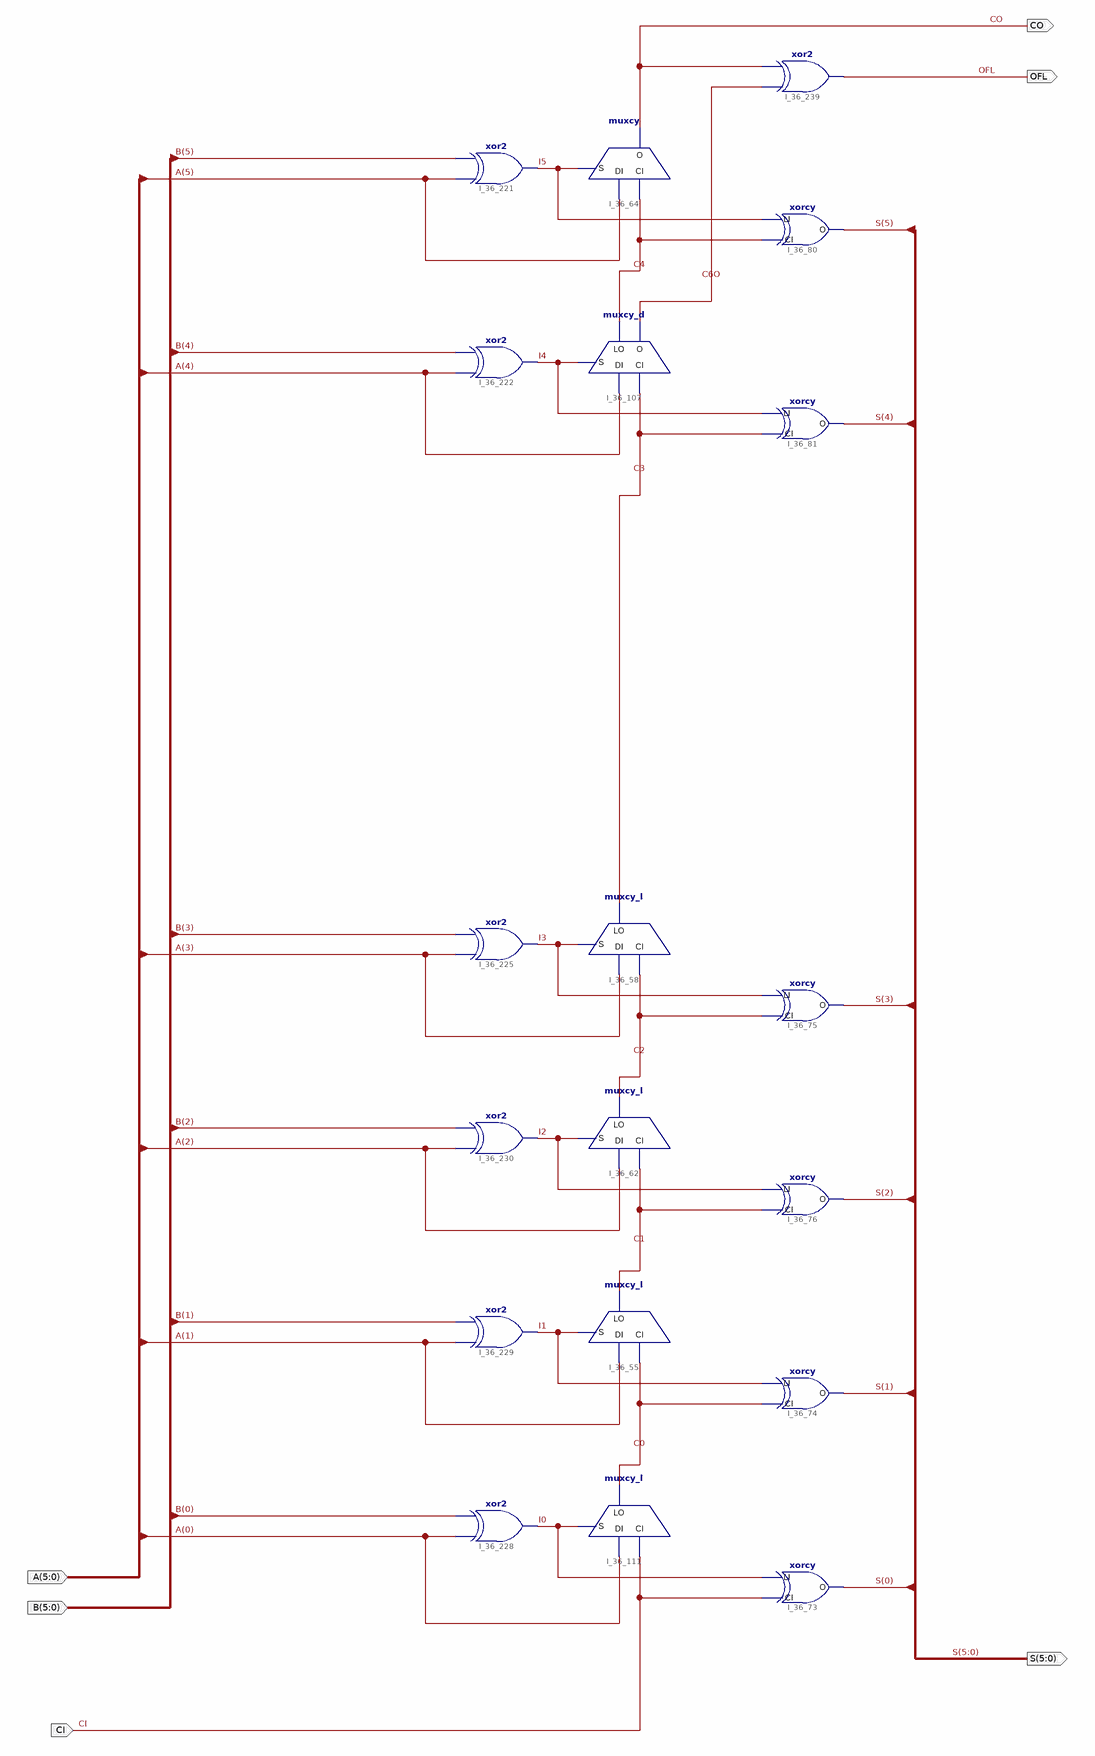
[diagram p0: schematic sheet 1]
// Xilinx ISE schematic add6.sch (spartan3e) as structural Verilog: 19 symbols, 6 ports
module add6 (
  input  CI,
  input  [5:0] B,
  input  [5:0] A,
  output CO,
  output OFL,
  output [5:0] S
);

  wire C0, C1, C2, C3, C4, C6O, I0, I1, I2, I3, I4, I5;

  muxcy_l #(.RLOC("X0Y1")) I_36_58 (.CI(C2), .DI(A[3]), .S(I3), .LO(C3));
  muxcy_l #(.RLOC("X0Y1")) I_36_62 (.CI(C1), .DI(A[2]), .S(I2), .LO(C2));
  muxcy_l #(.RLOC("X0Y0")) I_36_55 (.CI(C0), .DI(A[1]), .S(I1), .LO(C1));
  muxcy_l #(.RLOC("X0Y0")) I_36_111 (.CI(CI), .DI(A[0]), .S(I0), .LO(C0));
  xorcy I_36_80 (.CI(C4), .LI(I5), .O(S[5]));
  xorcy I_36_81 (.CI(C3), .LI(I4), .O(S[4]));
  xorcy I_36_75 (.CI(C2), .LI(I3), .O(S[3]));
  xorcy I_36_76 (.CI(C1), .LI(I2), .O(S[2]));
  xorcy I_36_74 (.CI(C0), .LI(I1), .O(S[1]));
  xorcy I_36_73 (.CI(CI), .LI(I0), .O(S[0]));
  muxcy #(.RLOC("X0Y3")) I_36_64 (.CI(C4), .DI(A[5]), .S(I5), .O(CO));
  xor I_36_221 (I5, A[5], B[5]);
  xor I_36_225 (I3, A[3], B[3]);
  xor I_36_222 (I4, A[4], B[4]);
  xor I_36_228 (I0, A[0], B[0]);
  xor I_36_229 (I1, A[1], B[1]);
  xor I_36_230 (I2, A[2], B[2]);
  xor I_36_239 (OFL, C6O, CO);
  muxcy_d #(.RLOC("X0Y3")) I_36_107 (.CI(C3), .DI(A[4]), .S(I4), .LO(C4), .O(C6O));
endmodule
